# EAGLE design ProtoTrinket (EAGLE 6.4)
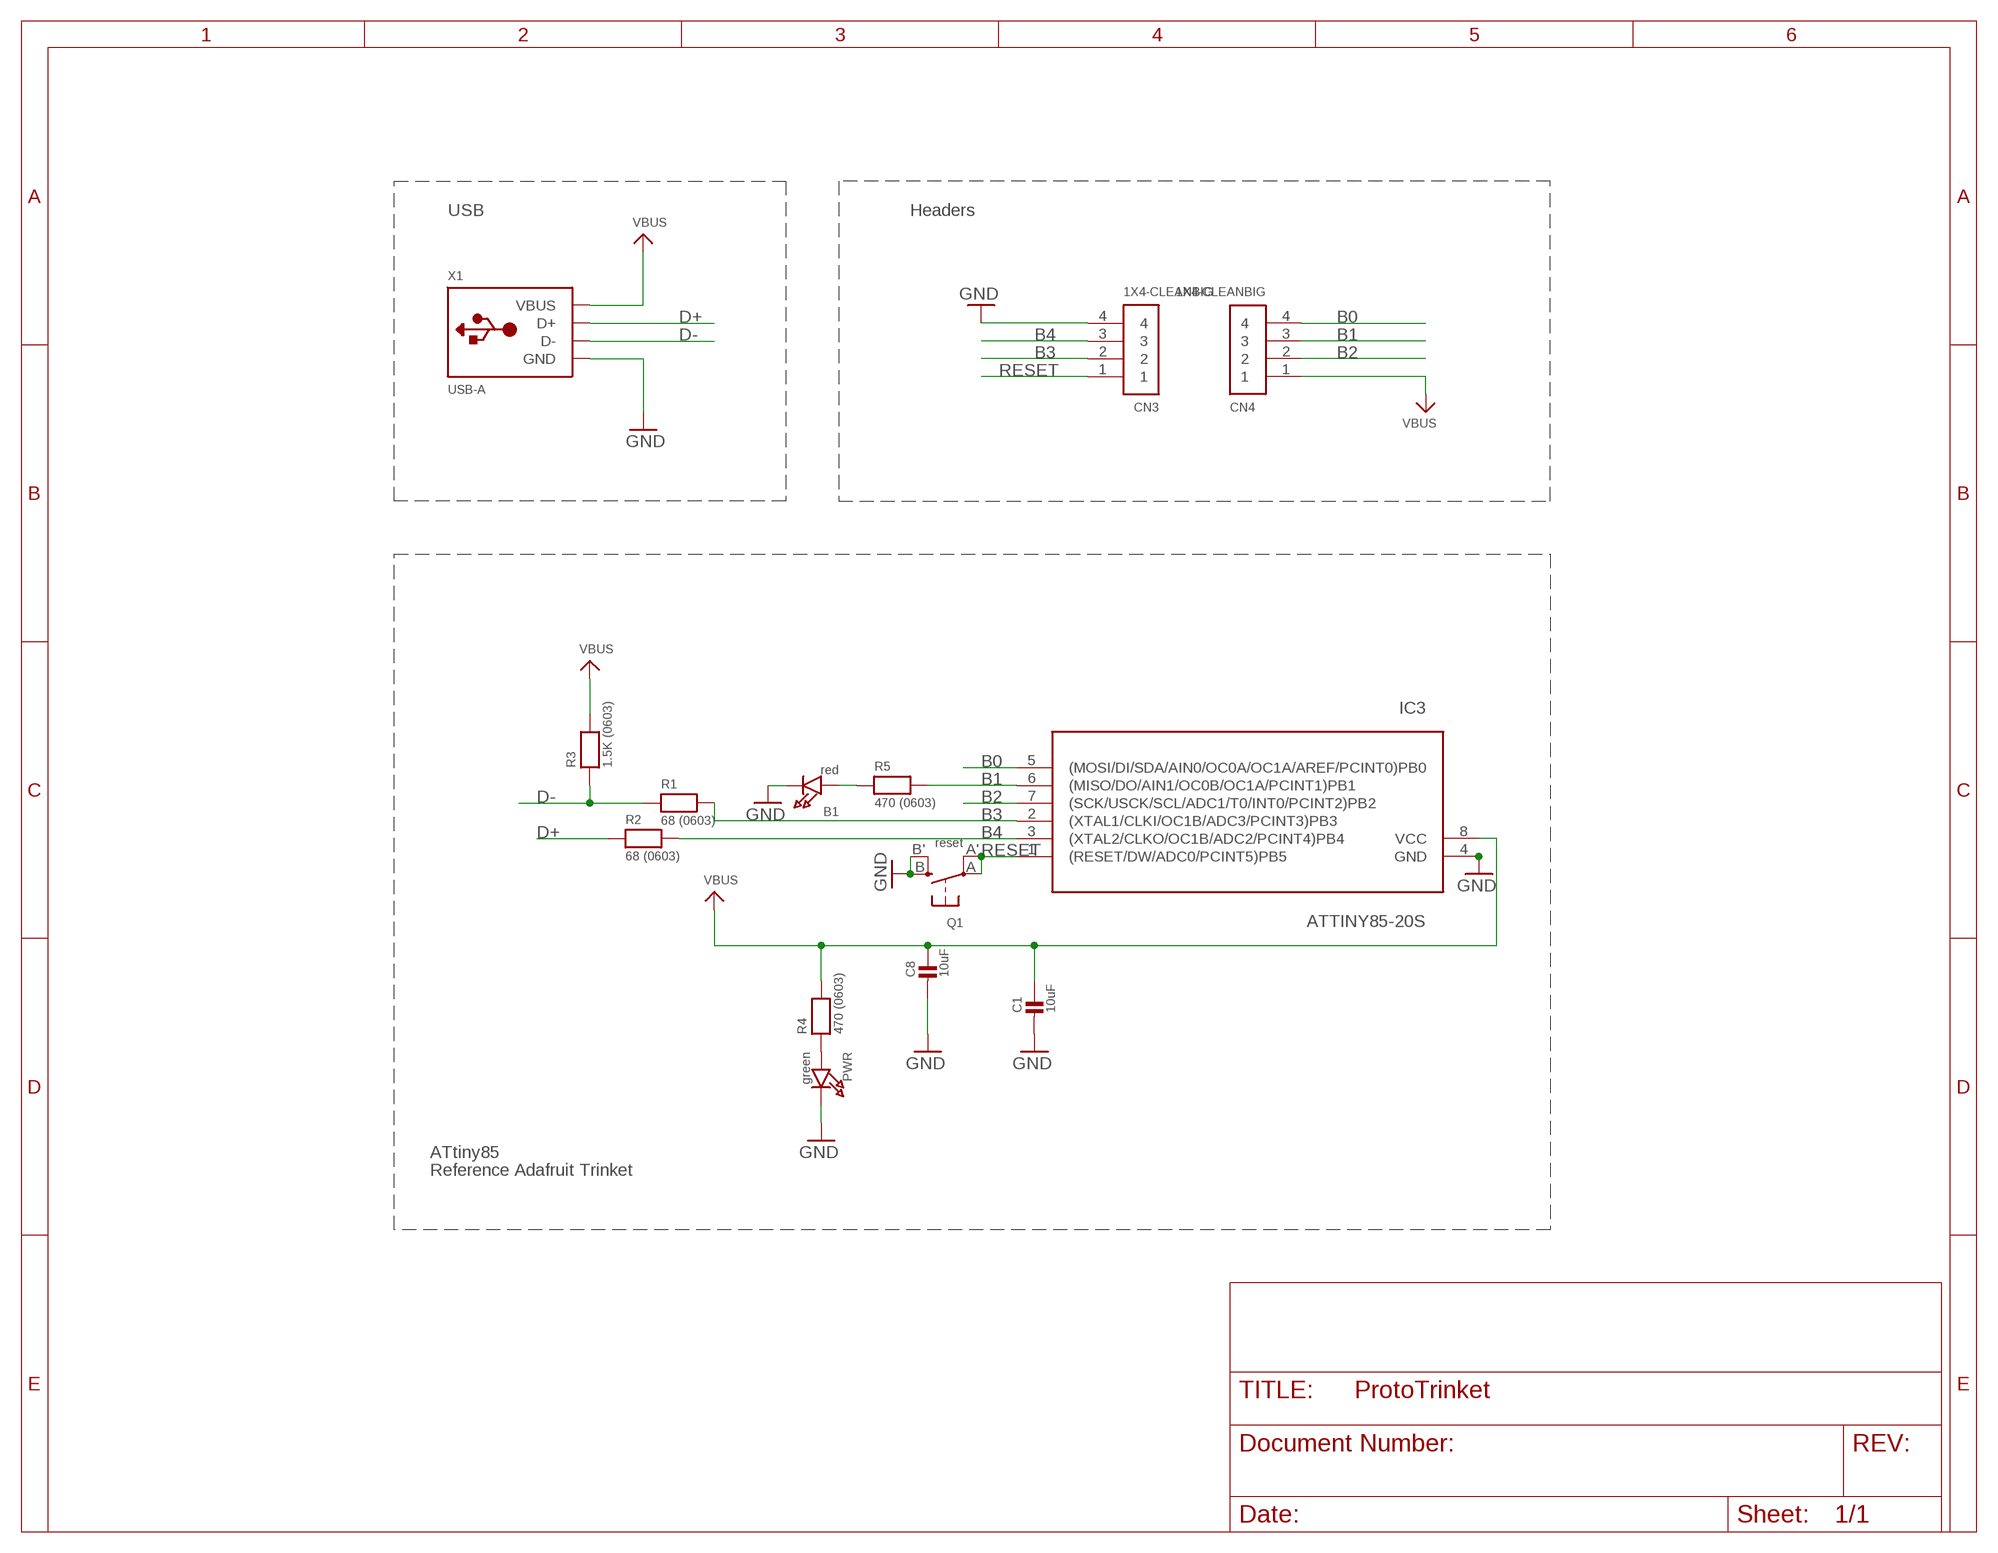
[diagram p0: schematic, sheet 1]

## Parts
B1  red  LED0805_NOOUTLINE  [CHIPLED_0805_NOOUTLINE]
C1  10uF  CAP_CERAMIC0805-NOOUTLINE  [0805-NO]
C8  10uF  CAP_CERAMIC0805-NOOUTLINE  [0805-NO]
CN3  1X4-CLEANBIG  [1X04-CLEANBIG]
CN4  1X4-CLEANBIG  [1X04-CLEANBIG]
IC3  ATTINY85-20S  ATTINY85V-10S  [SOIC8]
PWR  green  LED0805_NOOUTLINE  [CHIPLED_0805_NOOUTLINE]
Q1  reset  SWITCH_TACT_SMT4.6X2.8  [BTN_KMR2_4.6X2.8]
R1  68 (0603)  RESISTOR_0603_NOOUT  [0603-NO]
R2  68 (0603)  RESISTOR_0603_NOOUT  [0603-NO]
R3  1.5K (0603)  RESISTOR_0603_NOOUT  [0603-NO]
R4  470 (0603)  RESISTOR_0603_NOOUT  [0603-NO]
R5  470 (0603)  RESISTOR_0603_NOOUT  [0603-NO]
X1  USB-A  [MOLEX_480371000]

## Nets
B0: CN4.4 IC3.5((MOSI/DI/SDA/AIN0/OC0A/OC1A/AREF/PCINT0)PB0)
B1: CN4.3 IC3.6((MISO/DO/AIN1/OC0B/OC1A/PCINT1)PB1) R5.2
B2: CN4.2 IC3.7((SCK/USCK/SCL/ADC1/T0/INT0/PCINT2)PB2)
B3: CN3.2 IC3.2((XTAL1/CLKI/OC1B/ADC3/PCINT3)PB3) R1.2
B4: CN3.3 IC3.3((XTAL2/CLKO/OC1B/ADC2/PCINT4)PB4) R2.2
D+: R2.1 X1.3(D+)
D-: R1.1 R3.1 X1.2(D-)
GND: B1.C C1.2 C8.2 CN3.4 IC3.4(GND) PWR.C Q1.B'(S1) Q1.B(S) X1.4(GND)
N$1: B1.A R5.1
N$6: PWR.A R4.1
RESET: CN3.1 IC3.1((RESET/DW/ADC0/PCINT5)PB5) Q1.A'(P1) Q1.A(P)
VBUS: C1.1 C8.1 CN4.1 IC3.8(VCC) R3.2 R4.2 X1.1(VBUS)

## Notes on the sheet
- USB | Headers
- ATtiny85
- Reference Adafruit Trinket

## Library data of the parts
B1 PWR = microbuilder:LED: LED 0603 - 0603 Surface Mount Package 2mA: Green LED - Low Power (3.9mcd, 2ma, 1.7Vf) - Digikey: 475-2709-2-ND Orange LED - Low Power (9.8mcd, 2ma, 1.8Vf) - Digikey: 475-1194-2-ND Red LED - Low Power (5mcd, 2ma, 1.8Vf) - Digikey: 475-1195-2-ND Yellow LED - Low Power (7mcd, 2ma, 1.8Vf) - Digikey: 475-1196-2-ND 5mA: Blue LED - Low Power (17mcd, 5ma, 2.9Vf) - Digikey: LNJ937W8CRACT-ND 0805 - 0805 Surface Mount Package 2mA: Red LED (8.8mcd, 2mA, 1.8Vf, Clear) - Low Power [Digikey: 475-2510-1-ND] Green LED (5mcd, 2mA, 1.8Vf, Clear) - Low Power [Digikey: 475-2730-1-ND] Yellow LED (11.3mcd, 2mA, 1.8Vf, Clear) - Low Power [Digikey: 475-2555-1-ND] 20mA: Red LED (104mcd, 20mA, Diffused) - LS R976 [Digikey: 475-1278-6-ND] Red LED (12mcd, 20mA, 2.0Vf, Clear) - APT2012EC [Digikey: 754-1128-1-ND] Green LED (15mcd, 20mA, 2.2Vf, Clear) - APT2012GC [Digikey: 754-1131-1-ND] Orange LED (160mcd, 20mA, 2.1Vf, Clear) - APT2012SECK [Digikey: 754-1130-1-ND] 1206 - 1206 Surface Mount Package Green LED (26mcd, 20mA, Diffused) - LG N971 [Digikey: 475-1407-6-ND] Red LED (15mcd, 20mA, Diffused) - LH N974 [Digikey: 475-1416-6-ND] Cree - Cree High-Power Surface Mount LEDs XPEBWT-L1-0000-00D50 - White 111lm 350mA 2.9Vf 6200K 110° XTEAWT-00-0000-00000LEE3 - White 114lm 350mA 2.85Vf 5000K 115° Everlight - Everlight 45-21 Series Surface Mount LEDs 45-21/QK2C-B2832AC2CB2/2T - Warm White 2000mcd 20mA 3.25Vf 3050K 120° 45-21/LK2C-B38452C4CB2/2T - Nuetral White 2000mcd 20mA 3.25Vf 4150K 120° 45-21/LK2C-B50634C6CB2/2T - Cold White 2200mcd 20mA 3.25Vf 5650K 120° PLCC2 Reverse Mount LS T77K-J1L2-1-0-2-R18-Z - Red 11.25mcd 2mA 1.8Vf 630nm 120° LO T77K-L1M2-24-Z - Orange 19.6mcd 2mA 1.8Vf 606nm 120° LY T77K-K2M1-26-Z - Yellow 15.7mcd 2mA 1.8Vf 587nm 120°
C1 C8 = microbuilder:CAP_CERAMIC: Ceramic Capacitors For new designs, use the packages preceded by an '_' character since they are more reliable: The following footprints should be used on most boards: _0402 - Standard footprint for regular board layouts _0603 - Standard footprint for regular board layouts _0805 - Standard footprint for regular board layouts For extremely tight-pitch boards where space is at a premium, the following 'micro-pitch' footprints can be used (smaller pads, no silkscreen outline, etc.): _0402MP - Micro-pitch footprint for very dense/compact boards _0603MP - Micro-pitch footprint for very dense/compact boards _0805MP - Micro-pitch footprint for very dense/compact boards Commonly Stocked Parts 0402 - 0402 Surface Mount Capacitors 16pF 50V 5% [Digikey: 445-4899-2-ND] 18pF 50V 5% [Digikey: 490-1281-2-ND] 22pF 50V 5% [Digikey: 490-1283-2-ND] 68pF 50V 5% [Digikey: 490-1289-2-ND] 0.1uF 10V 10% [Digikey: 490-1318-2-ND] 1.0uF 6.3V 10% [Digikey: 490-1320-2-ND] 0603 - 0603 Surface Mount Capacitors 16 pF 50V 5% [Digikey: 445-5051-2-ND] 22 pF 50V [Digikey: PCC220ACVTR-ND] 33 pF 50V 5% [Digikey: 490-1415-1-ND] 56pF 50V 5% [Digikey: 490-1421-1-ND] 220pF 50V 5% [Digikey: 445-1285-1-ND] 680 pF 50V 2200 pF 50V 5% C0G [Digikey: 445-1297-1-ND] 5600 pF 100V 5% X7R [Digikey: 478-3711-1-ND] 0.1 µF 25V 10% [Digikey: PCC2277TR-ND] 0.22 µF 16V 10% X7R [Digikey: 445-1318-1-ND] 1.0 µF 25V 10% [Digikey: 445-5146-2-ND] 0603 - RF Specific 3pF 250V +/-0.1pF RF [Digikey: 712-1347-1-ND] 18 pF 250V 5% [Digikey: 478-3505-1-ND or 712-1322-1-ND] 56 pF 250V 5% C0G RF [Digikey: 490-4867-1-ND] 68 pF 250V RF [Digikey: 490-4868-1-ND] 0805 - 0805 Surface Mount Capacitors 220 pF 250V 2% RF Ceramic Capacitor [Digikey: 712-1398-1-ND] 1000 pF 50V 2% NP0 Ceramic Capacitor [Digikey: 478-3760-1-ND] 0.1 µF 25V 10% Ceramic Capacitor [Digikey: PCC1828TR-ND] 1.0 µF 16V 10% Ceramic Capacitor[Digikey: 490-1691-2-ND] 10.0 µF 10V 10% Ceramic Capacitor[Digikey: 709-1228-1-ND] 10.0 uF 16V 10% Ceramic Capacitor [Digikey: 478-5165-2-ND] 47 uF 6.3V 20% Ceramic Capacitor [Digikey: 587-1779-1-ND or 399-5506-1-ND] 1206 - 1206 Surface Mount Capacitors 47uF 10V 20% Ceramic Capacitor [Digikey: 490-5528-1-ND or 399-5508-1-ND or 445-6010-1-ND] 100uF 6.3V -20%, +80% Y5V Ceramic Capacitor (Digikey: 490-4512-1-ND, Mouser: 81-GRM31CF50J107ZE1L)
CN3 CN4 = adafruit:1X4: 4-pin connector
IC3 = avr:ATTINY85: MICROCONTROLLER 8 Kbytes FLASH 512 bytes EEPROM 512 bytes RAM 4-channel 10 bit ADC USI
Q1 = microbuilder:SWITCH_TACT_SMT: SMT Tact Switches 6x6mm - Digikey: P12940SCT-ND KMR2 (4.6x2.8mm) - Digikey: 401-1426-1-ND EVQ-PQHB55 - Light Touch, 160GF (4.5x4.5mm) - Digikey: P8090SCT-ND KMT0 - KMT021 NGJ LHS (etc.) IP68/Waterproof - Digikey: CKN10289CT-ND
R1-R5 = microbuilder:RESISTOR: Resistors For new designs, use the packages preceded by an '_' character since they are more reliable: The following footprints should be used on most boards: _0402 - Standard footprint for regular board layouts _0603 - Standard footprint for regular board layouts _0805 - Standard footprint for regular board layouts For extremely tight-pitch boards where space is at a premium, the following 'micro-pitch' footprints can be used (smaller pads, no silkscreen outline, etc.): _0402MP - Micro-pitch footprint for very dense/compact boards _0603MP - Micro-pitch footprint for very dense/compact boards _0805MP - Micro-pitch footprint for very dense/compact boards
X1 = adafruit:USB-A: USB type A 'plug' Used for things that can directly connect to a USB port, say USB key

## Net classes
1 power: width 0.305 mm

## Board
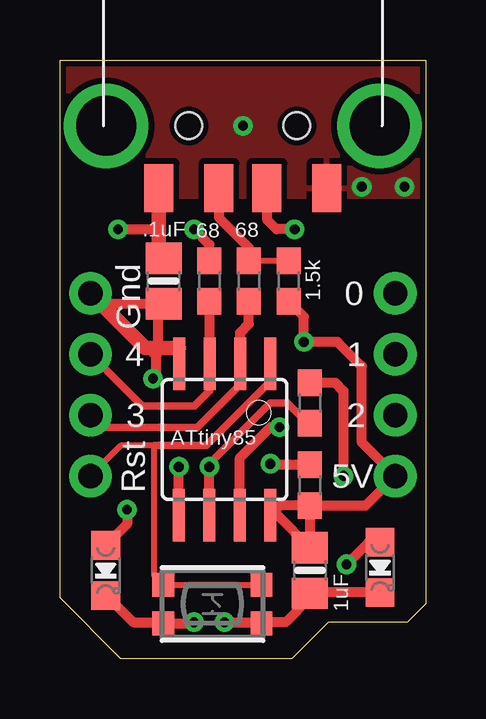
[diagram p1: board, top side]
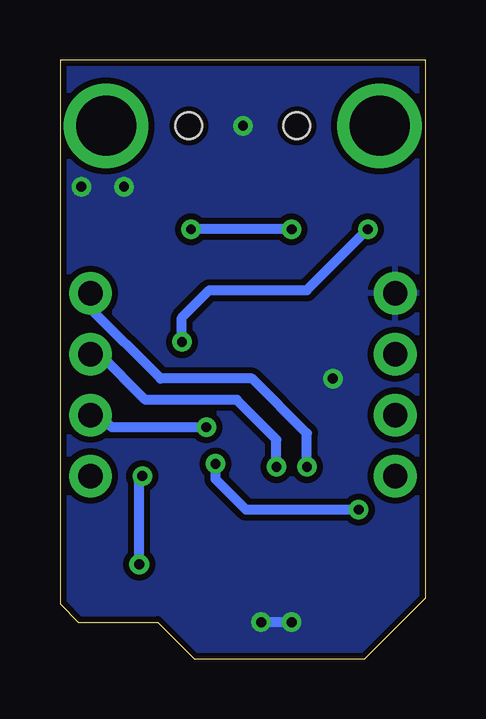
[diagram p2: board, bottom side, seen from below]

Size 15.24 x 24.97 mm. Coordinates in mm from the lower left corner, seen from the top.
Outline: 15.24,24.97 15.24,2.29 14.48,1.52 11.18,1.52 9.65,0 2.54,0 0,2.54 0,24.97 15.24,24.97
Copper layers (1*16): Top 0.035mm / dielectric 1.5mm / Bottom 0.035mm
Design rules "adafruit *": minimum track width 8mil, minimum drill 15.5mil, track to track 10mil, track to pad 10mil, pad to pad 10mil, via to via 10mil, smd to smd 8mil, copper to edge 10mil, drill to drill 8mil, minimum pad ring 10mil, minimum via ring 8mil, stop-mask expansion 4mil, vias tented up to drill 20mil, thermal gap 10mil

### Footprints (pad centres in the part's own frame; a part is rotated, then mirrored left to right if it is on the bottom)
CHIPLED_0805_NOOUTLINE = smd 1.2 x 1.2: A 0,-1.05; C 0,1.05
0805-NO = smd 1.3 x 1.5: 1 -0.95,0; 2 0.95,0
1X04-CLEANBIG = drill 1.016 pad 1.778: 1 -3.81,0; 2 -1.27,0; 3 1.27,0; 4 3.81,0
SOIC8 = smd 0.5 x 2.2: 1 -1.905,-3.154; 2 -0.645,-3.154; 3 0.625,-3.154; 4 1.895,-3.154; 5 1.905,3.154; 6 0.635,3.154; 7 -0.635,3.154; 8 -1.905,3.154
BTN_KMR2_4.6X2.8 = smd 0.9 x 1: A 2.05,0.8; A' -2.05,0.8; B 2.05,-0.8; B' -2.05,-0.8
0603-NO = smd 1.1 x 1: 1 -0.85,0; 2 0.85,0
MOLEX_480371000 = smd 1.2 x 2: 1 3.5,2.6; 2 1,2.6; 3 -1,2.6; 4 -3.5,2.6 | drill 2.5: M1 -5.7,0; M2 5.7,0 | hole 1.1: -2.25,0; 2.25,0

### Placement (x,y rotation side)
B1  13.34,3.81 180 top
C1  4.32,15.75 270 top
C8  10.41,3.68 270 top
CN3  1.27,11.43 90 top
CN4  13.97,11.43 90 top
IC3  6.86,9.14 180 top
PWR  1.91,3.68 180 top
Q1  6.35,2.29 0 top
R1  7.87,15.75 270 top
R2  6.22,15.75 270 top
R3  9.53,15.75 270 top
R4  10.41,7.24 270 top
R5  10.41,10.67 270 top
X1  7.62,22.23 180 top

### Tracks (layer width: path | path; a pad name or v marks a point on that pad's centre or on a via)
B0  (via drill 0.41)
  Top 0.406: IC3.5 v4.95,8
  Bottom 0.406: v4.95,8 4.95,9.4 7.24,11.68 11.05,11.68 13.97,14.61 CN4.4 13.97,15.11
B1  (via drill 0.41)
  Top 0.254: 10.16,9.97 10.41,9.97 R5.2
  Top 0.305: v6.22,8 6.22,8.13 8.76,10.67 9.46,10.67 10.16,9.97
  Top 0.406: IC3.6 v6.22,8
  Bottom 0.406: v6.22,8 6.22,9.14 7.87,10.8 11.68,10.8 13.59,12.7 CN4.3
B2  (via drill 0.41)
  Top 0.406: IC3.7 7.49,8.38 8.76,9.65 v9.14,9.65
  Bottom 0.406: v9.14,9.65 13.08,9.65 13.59,10.16 CN4.2
B3
  Top 0.305: IC3.2 7.5,11.44 5.71,9.65 1.78,9.65 CN3.2
  Top 0.406: IC3.2 7.5,13.6 7.87,13.97 R1.2
B4
  Top 0.305: IC3.3 6.23,11.19 5.59,10.54 3.43,10.54 CN3.3
  Top 0.406: R2.2 IC3.3
D+  (via drill 0.41)
  Top 0.406: R2.1 6.22,17.27 v5.59,17.91 | v9.78,17.91 9.02,17.91 8.64,18.29 8.64,19.61 X1.3
  Bottom 0.406: v5.59,17.91 v9.78,17.91
D-
  Top 0.254: R1.1 R3.1
  Top 0.406: X1.2 6.62,18.4 7.87,17.14 R1.1
GND  (via drill 0.41)
  Top 0.305: 4.96,12.18 IC3.4 4.96,12.94 4.95,12.95 | 4.01,11.82 v3.87,11.68
  Top 0.406: 4.96,12.18 4.96,11.82 | B1.C 10.41,2.76 C8.2 10.41,2.54 9.4,1.52 8.44,1.52 Q1.B 8.36,1.52 v6.86,1.52 | C1.2 4.08,14.8 | 4.08,14.8 1.71,14.8 CN3.4 | 4.01,11.82 4.01,12.63 3.68,12.95 | 4.08,14.8 4.08,12.85 4.06,12.83 | PWR.C 1.94,2.63 3.05,1.52 4.26,1.52 Q1.B' 5.55,1.49 v5.59,1.52
  Top 0.61: CN3.4 3.56,12.95 3.68,12.95 4.95,12.95
  Bottom 0.406: v5.59,1.52 v6.86,1.52
  other vias: 12.57,19.69 14.35,19.69 7.62,22.23
  pour Bottom: -0.25,29.84 0,-0.25 15.37,-0.38 14.99,29.46
  pour Top: 0.25,29.84 0.25,19.3 15.11,19.3 15.11,29.84
N$1  (via drill 0.41)
  Top 0.406: R5.1 11.47,11.52 11.81,11.18 v11.81,7.62 | B1.A 12.86,4.86 v11.94,3.94
  Bottom 0.406: v11.94,3.94 11.94,7.49 v11.81,7.62
N$6  (via drill 0.41)
  Top 0.406: R4.1 8.8,8.09 v8.76,8.13 | v2.79,6.22 2.79,5.62 PWR.A
  Bottom 0.406: v8.76,8.13 8.76,7.49 7.49,6.22 v2.79,6.22
RESET
  Top 0.254: 1.42,7.62 CN3.1 2.54,8.89 3.94,8.89 3.94,3.45 Q1.A' Q1.A
  Top 0.305: 3.94,8.89 6.1,8.89 8.76,11.56 IC3.1
VBUS  (via drill 0.41)
  Top 0.406: R4.2 C8.1 9.06,5.99 IC3.8 | R4.2 9.18,6.39 8.76,5.97 | R3.2 10.16,14.26 v10.16,13.21 11.56,13.21 12.57,12.19 12.57,9.02 CN4.1 12.74,6.39 R4.2 | v2.41,17.91 4.12,17.91
  Top 0.61: X1.1 4.12,17.91 4.12,16.9 C1.1
  Bottom 0.406: v10.16,13.21 10.16,14.22 9.02,15.37 4.95,15.37 v2.41,17.91

### Text on the board
tPlace: .1uF | 68 | 68 | Gnd | 1.5k | 0 | 4 | 1 | 3 | 2 | ATtiny85 | Rst | 5V | 1uF